# EAGLE design OPNpool r1.0 (EAGLE 9.6.2)
REV: 0.1
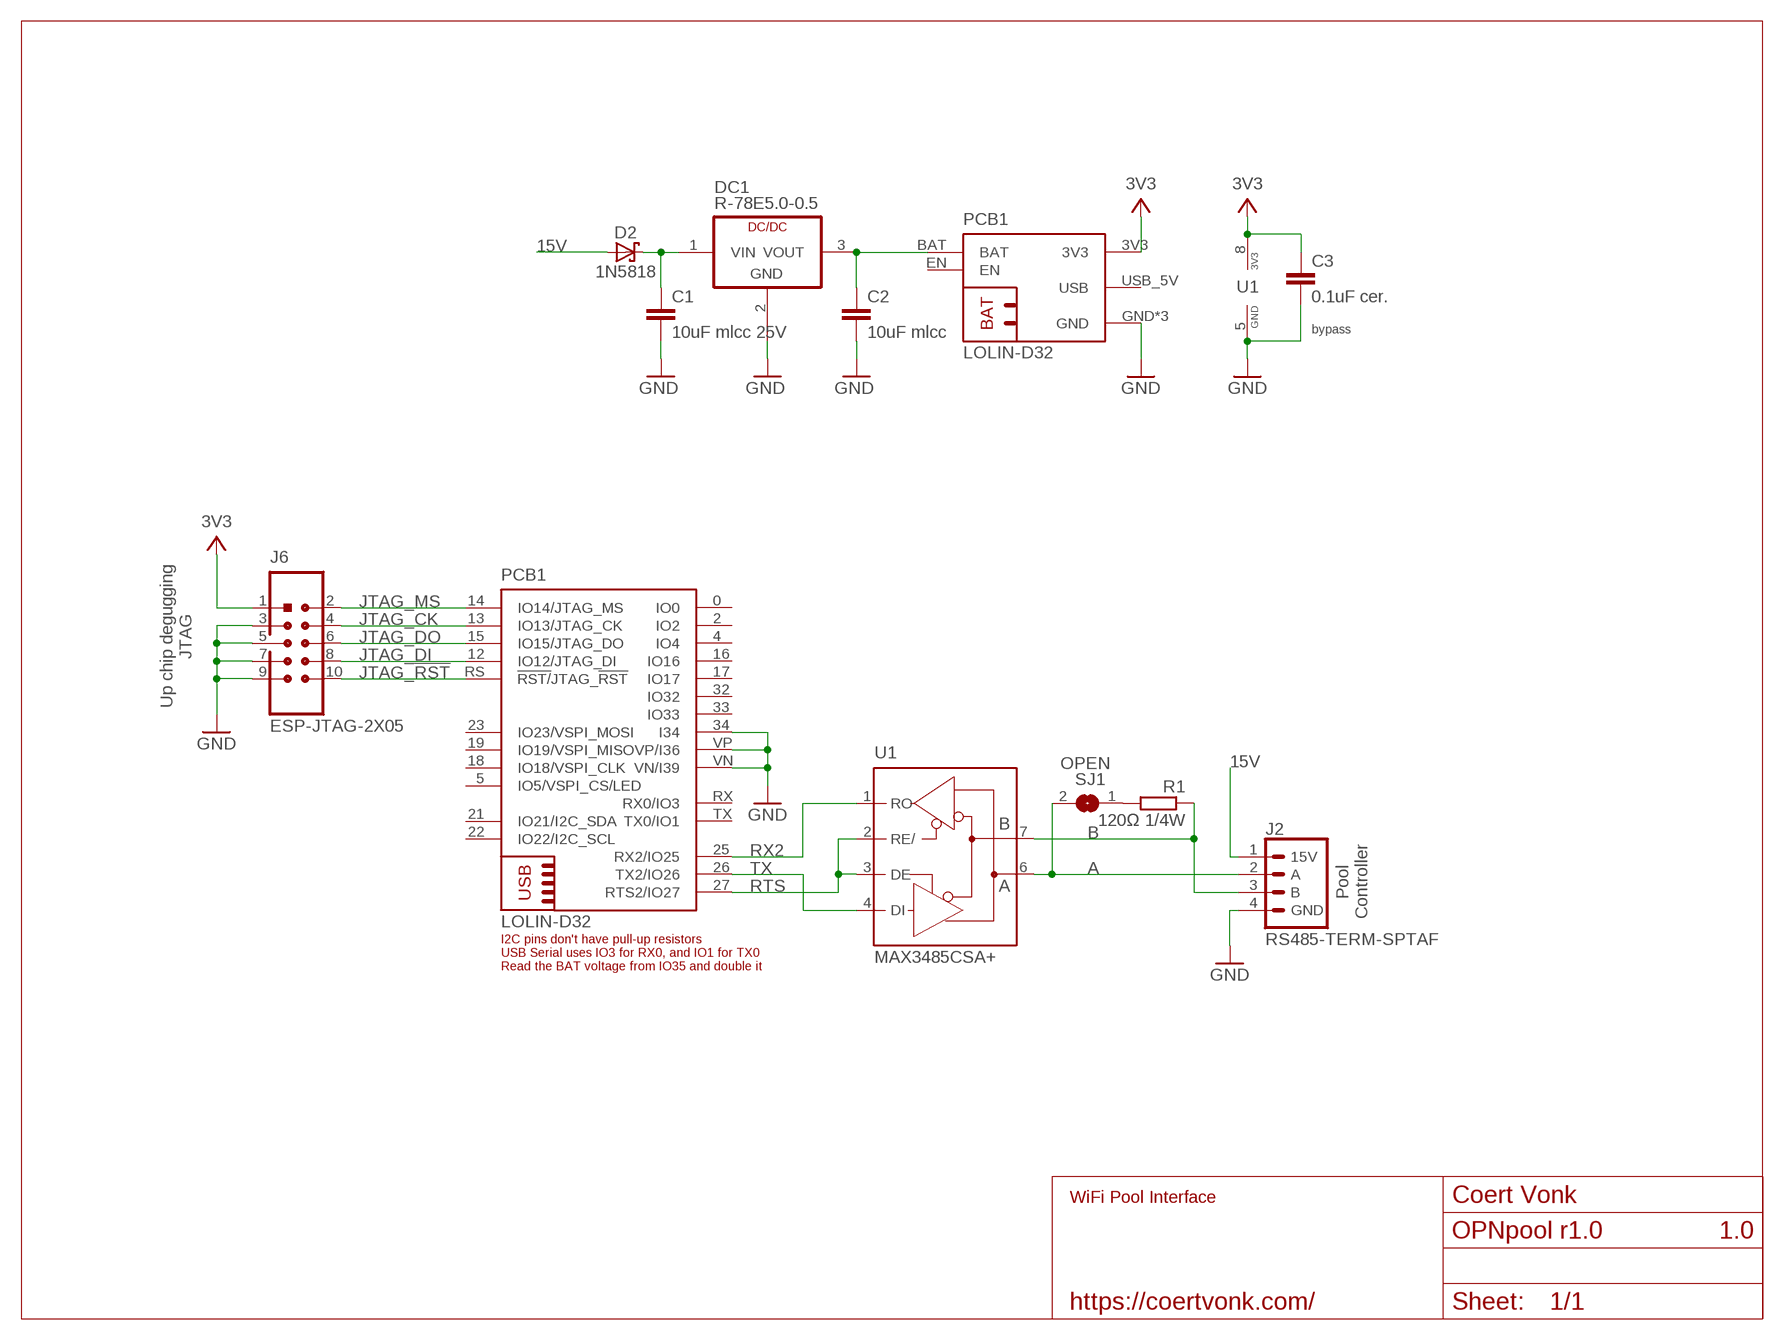
[diagram p0: schematic, sheet 1]
U$1 (FRAME_LETTER_L): AUTHOR_NAME: Coert Vonk; DESCRIPTION: WiFi Pool Interface; REV: 1.0; URL: https://coertvonk.com/

## Parts
C1  10uF mlcc 25V  C-EUC0805K  [C0805K]
C2  10uF mlcc  C-EUC0805K  [C0805K]
C3  0.1uF cer.  C-EUC0805K  [C0805K]
D2  1N5818  [DO41-7.6]
DC1  R-78E5.0-0.5  [SIP3]
J2  RS485-TERM-SPTAF  [SPTAF1/4-5,0-LL]
J6  ESP-JTAG-2X05  [2X05_SHROUDED]
PCB1  LOLIN-D32  [LOLIN-D32]
R1  120Ω 1/4W  R-EU_R0805  [R0805]
SJ1  OPEN  SJ  [SJ]
U1  MAX3485CSA+  [SO08]

## Nets
3V3: C3.1 J6.1(3V3) PCB1.3V3(P:3V3) U1.8(P:VCC)
15V: D2.A J2.1(15V)
A: J2.2(A) SJ1.2 U1.6(A)
B: J2.3(B) R1.1 U1.7(B)
GND: C1.2 C2.2 C3.2 DC1.2(GND) J2.4(GND) J6.3(GND) J6.5(GND) J6.7(GND) J6.9(GND) PCB1.34(I34) PCB1.GND(P:GND) PCB1.GND@1(P:GND) PCB1.GND@2(P:GND) PCB1.VN(VN/I39) PCB1.VP(VP/I36) U1.5(P:GND)
JTAG_!RST: J6.10(NC) PCB1.RS(!RST/!JTAG_!RST)
JTAG_CK: J6.4(TCK) PCB1.13(IO13/JTAG_CK)
JTAG_DI: J6.8(TDI) PCB1.12(IO12/JTAG_DI)
JTAG_DO: J6.6(TDO) PCB1.15(IO15/JTAG_DO)
JTAG_MS: J6.2(TMS) PCB1.14(IO14/JTAG_MS)
N$5: R1.2 SJ1.1
RTS: PCB1.27(RTS2/IO27) U1.2(RE/) U1.3(DE)
RX2: PCB1.25(RX2/IO25) U1.1(RO)
TX: PCB1.26(TX2/IO26) U1.4(DI)
VIN: C1.1 D2.C DC1.1(VIN)
VOUT: C2.1 DC1.3(VOUT) PCB1.BAT(P:BAT)
Unconnected: PCB1.0(IO0) PCB1.2(IO2) PCB1.4(IO4) PCB1.5(IO5/VSPI_CS/LED) PCB1.16(IO16) PCB1.17(IO17) PCB1.18(IO18/VSPI_CLK) PCB1.19(IO19/VSPI_MISO) PCB1.21(IO21/I2C_SDA) PCB1.22(IO22/I2C_SCL) PCB1.23(IO23/VSPI_MOSI) PCB1.32(IO32) PCB1.33(IO33) PCB1.EN(P:EN) PCB1.RX(RX0/IO3) PCB1.TX(TX0/IO1) PCB1.USB_5V(P:USB)

## Notes on the sheet
- bypass
- Up chip degugging
  JTAG
- Pool
  Controller

## Library data of the parts
C1 C2 = rcl:C-EU: CAPACITOR, European symbol; MANF: Murata Electronics; MANF#: GJ821BR61E106KE11L; MOUSER#: 81-GJ821BR61E106KE1L; SPICEPREFIX: C
C3 = rcl:C-EU: CAPACITOR, European symbol; MANF: KEMET; MANF#: C0805C104K1RECAUTO; MOUSER#: 80-C0805C104K1REAUTO; SPICEPREFIX: C
D2 = Coert Vonk:1N581*: 1.0A SCHOTTKY BARRIER RECTIFIER Source: http://www.diodes.com/datasheets/ds23001.pdf; MANF: Rectron; MANF#: 1N5818-T; MOUSER#: 583-1N5818-T
DC1 = Coert Vonk:R-78E*-0.5: DC/DC-Converter 5V 500 mA Technical specifications: Manufacturer: Recom Input Voltage: 7 - 28 V Output Voltage: 5 V Output Current: 500 mA Mfr.: R-78E5.0-0.5, data sheet <http://www.recom-power.com/pdf/Innoline/R-78Exx-0.5.pdf> Mouser: 919-R-78E5.0-0.5, abt. $2.70; MANF: RECOM Power; MANF#: R-78E5.0-0.5; MOUSER#: 919-R-78E5.0-0.5
J2 = Coert Vonk:RS485-TERM: SPTAF 1/ 4-5,0-LL - 1864451, PCB push terminal block Technical specifications: Manufacturer: Phoenix Contact Current Rating: 13.5 A Voltage Rating: 320 V Wire Gauge Range: 24 AWG to 18 AWG Mfr.#: 1864451 Mouser: 651-1864451, abt. $1.85; MANF: Phoenix Contact; MANF#: 1864451; MOUSER#: 651-1864451
J6 = Coert Vonk:ESP-JTAG: 10-pin JTAG Header, shrouded header, 2-row, 2.54 pitch Specifications: Manufacturer: Molex Voltage rating: 250 VDC Current rating: 2.5 A Operating temperature: -55 - 120 C Mfr.#: 70246-1004 Mouser #: 538-70246-1004, about $1.19, data sheet <https://www.mouser.com/datasheet/2/276/0702461004_PCB_HEADERS-229930.pdf>; DIGIKEY#: WM3478-ND; MANF: Molex; MANF#: 70246-1004; MOUSER#: 538-70246-1004
PCB1 = Coert Vonk:LOLIN-D32: Wemos LOLIN D32, ESP-WROOM-32 Technical specifications: Manufacturer: Wemos SoC: ESP32-WROOM-32, 4 MByte flash, max 240MHz Optional battery: 3.7V Lipo, connector PH-2(2.0mm) UART: CH340, micro-USB connector Mfr.#: LOLIN D32, data sheet <https://wiki.wemos.cc/products:d32:d32> Alibaba: 32808551116, about $6.50; ALIEXPRESS#: 32808551116; MANF: WEMOS Electronics; MANF#: D32
R1 = rcl:R-EU_: RESISTOR, European symbol; MANF: Bourns; MANF#: CRM0805-JW-1R5ELF; MOUSER#: 652-CRM0805JW1R5ELF; SPICEPREFIX: R
SJ1 = jumper:SJ: SMD solder JUMPER
U1 = Coert Vonk:MAX3485CSA+: RS-485 Transceiver 3.3V SMD Technical specifications: Manufacturer: Maxim Integrated Operating supply: 3.3 V, 1.1 mA Output: 3 V, 20 mA Data rate: 10 Mb/s Temperature range: 0 - 70 C Mfr.: R-78E5.0-0.5 Mouser: 919-R-78E5.0-0.5, abt. $2.70, details <https://www.mouser.com/ProductDetail/Maxim-Integrated/MAX3485CSA%2b>; MANF: Maxim Integrated; MANF#: MAX3485CSA+; MF: MAXIM; MOUSER#: 700-MAX3485CSA; MPN: MAX481CSA; OC_FARNELL: unknown; OC_NEWARK: 90C3817

## Board
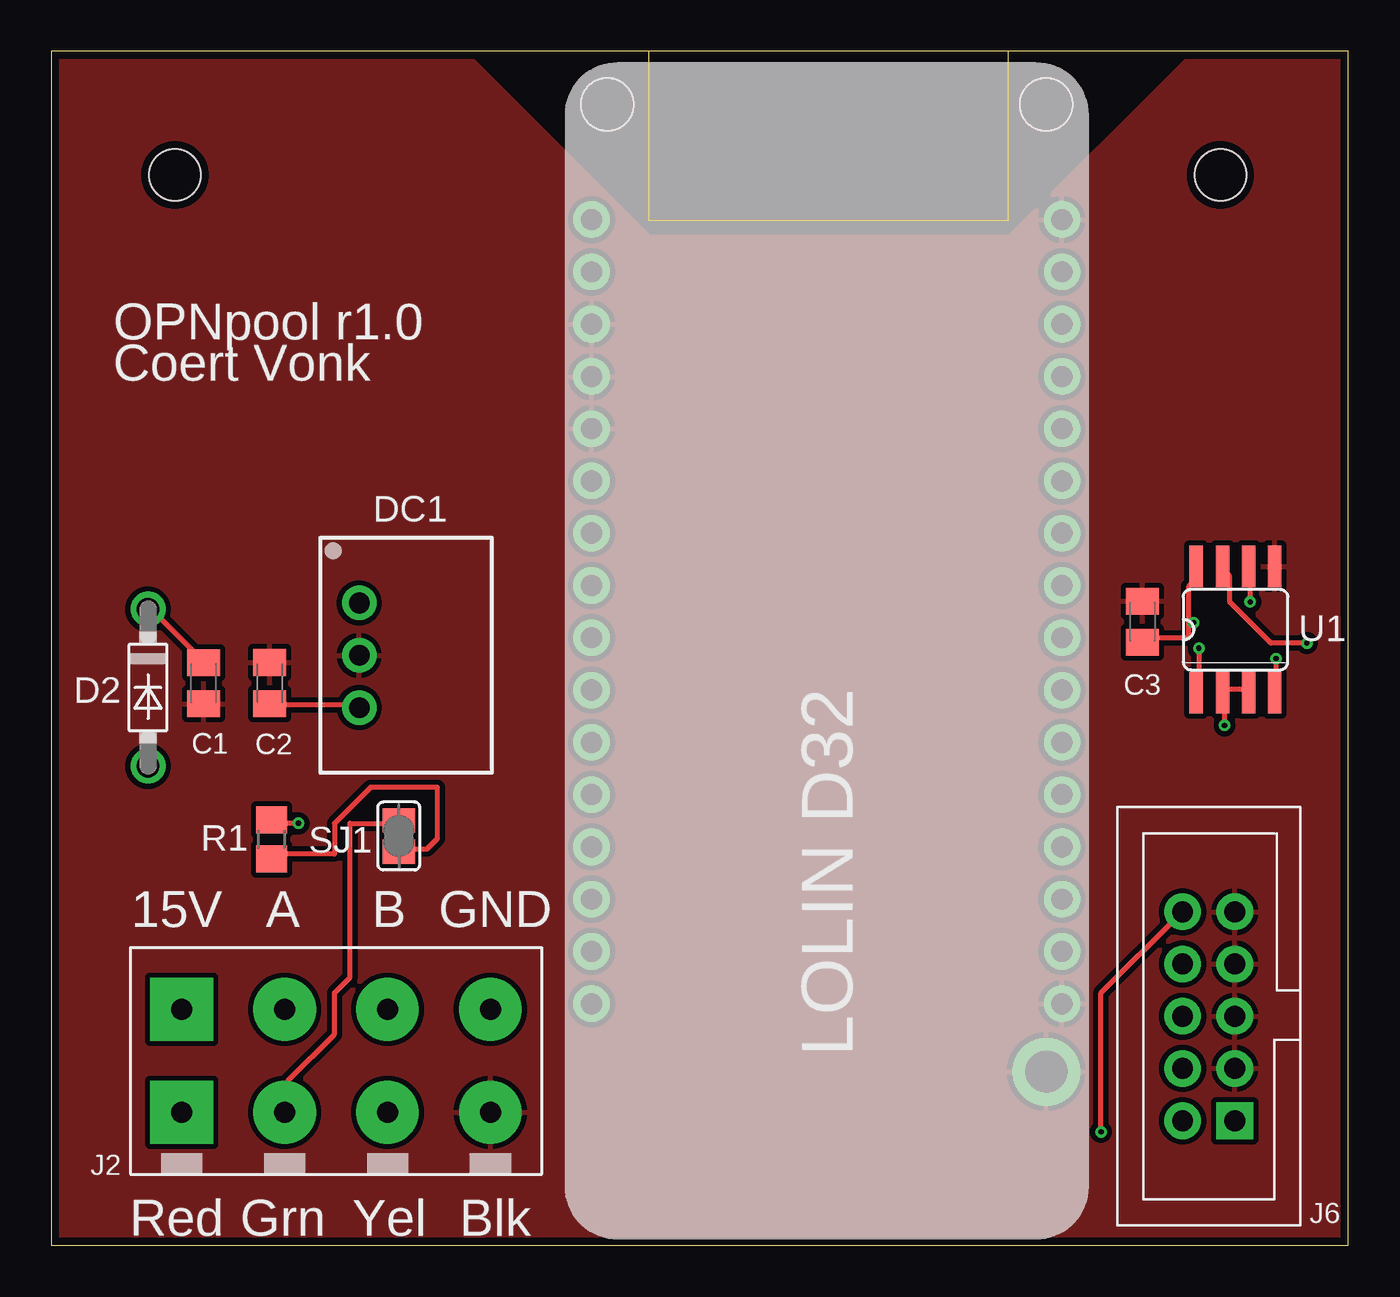
[diagram p1: board, top side]
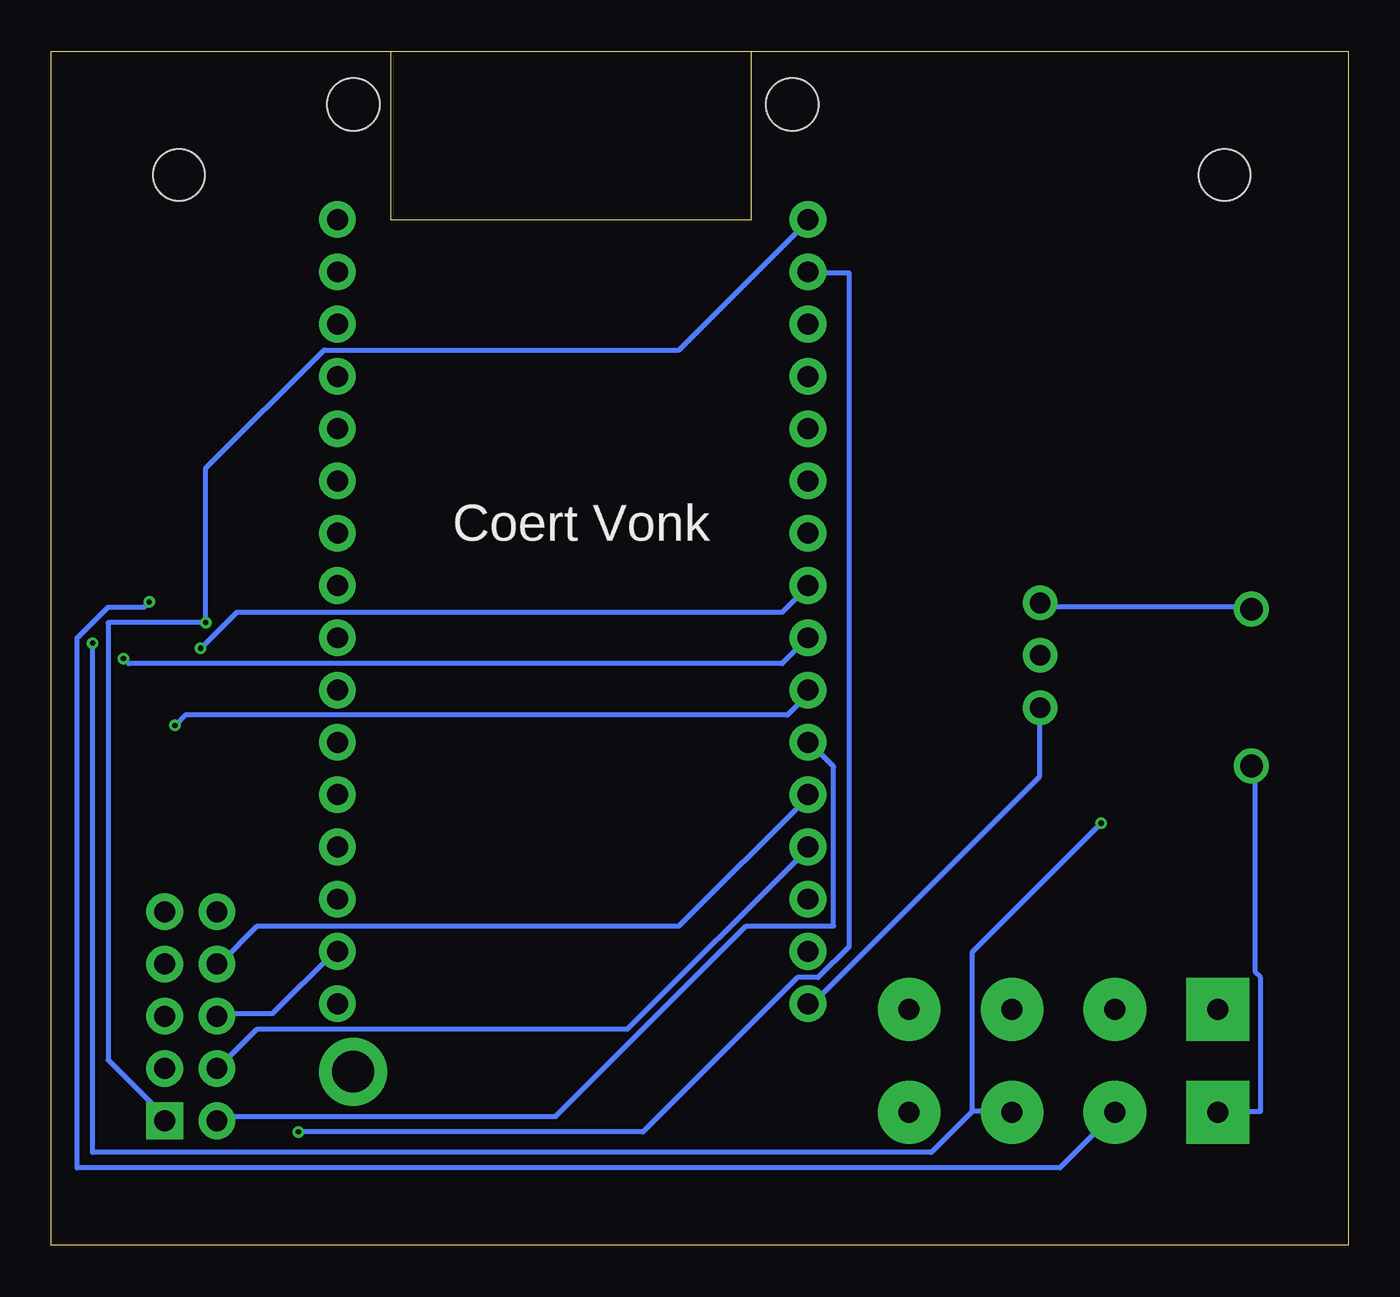
[diagram p2: board, bottom side, seen from below]

Size 63 x 58 mm. Coordinates in mm from the lower left corner, seen from the top.
Outline: 0,58 0,0 63,0 63,58 0,58
Copper layers (1*16): Top 0.035559375mm / dielectric 1.6mm / Bottom 0.035559375mm
Design rules "oshpark-2layer-auto-routing": minimum track width 10mil, minimum drill 10mil, track to track 10mil, track to pad 8mil, pad to pad 8mil, via to via 8mil, smd to smd 6mil, copper to edge 15mil, drill to drill 6mil, minimum pad ring 6mil, minimum via ring 6mil, stop-mask expansion 2.5mil, vias tented up to drill 0mil, thermal gap 10mil
Holes 2.5 mm at 6,52 56.8,52
tRestrict: area 29,50 to 47,58
bRestrict: area 29,50 to 47,58
Milling: area 29,49.8 to 46.5,58

### Footprints (pad centres in the part's own frame; a part is rotated, then mirrored left to right if it is on the bottom)
C0805K = smd 1.3 x 1.6: 1 -1,0; 2 1,0
DO41-7.6 = drill 1.1 pad 1.7: A 3.81,0; C -3.81,0
SIP3 = drill 1 pad 1.676: 1 -2.54,-2.54; 2 0,-2.54; 3 2.54,-2.54
SPTAF1/4-5,0-LL = drill 1.016 pad 3.048 square: 1 -7.713,-2.54; 1@1 -7.713,2.46 | drill 1.016 pad 3.048: 2 -2.713,-2.54; 2@1 -2.713,2.46; 3 2.287,-2.54; 3@1 2.287,2.46; 4 7.287,-2.54; 4@1 7.287,2.46
2X05_SHROUDED = drill 1.016 pad 1.778 square: 1 -5.08,-1.27 | drill 1.016 pad 1.778: 2 -5.08,1.27; 3 -2.54,-1.27; 4 -2.54,1.27; 5 0,-1.27; 6 0,1.27; 7 2.54,-1.27; 8 2.54,1.27; 9 5.08,-1.27; 10 5.08,1.27
LOLIN-D32 = drill 1.016 pad 1.778: 0 -10.16,-10.16; 2 -12.7,-10.16; 3V3 20.32,12.7; 4 -7.62,-10.16; 5 0,-10.16; 12 -7.62,12.7; 13 -10.16,12.7; 14 -5.08,12.7; 15 -15.24,-10.16; 16 -5.08,-10.16; 17 -2.54,-10.16; 18 2.54,-10.16; 19 5.08,-10.16; 21 7.62,-10.16; 22 15.24,-10.16; 23 17.78,-10.16; 25 2.54,12.7; 26 0,12.7; 27 -2.54,12.7; 32 7.62,12.7; 33 5.08,12.7; 34 10.16,12.7; BAT -17.78,12.7; EN -12.7,12.7; GND -17.78,-10.16; GND@1 20.32,-10.16; RS 17.78,12.7; RX 10.16,-10.16; TX 12.7,-10.16; USB_5V -15.24,12.7; VN 12.7,12.7; VP 15.24,12.7 | drill 2.032 pad 3.302: GND@2 -21.082,-9.398 | hole 2.54: 25.908,11.938; 25.908,-9.398
R0805 = smd 1.3 x 1.5: 1 -0.95,0; 2 0.95,0
SJ = smd 1.168 x 1.6: 1 -0.762,0; 2 0.762,0
SO08 = smd 0.66 x 2.032: 1 -1.905,-3.073; 2 -0.635,-3.073; 3 0.635,-3.073; 4 1.905,-3.073; 5 1.905,3.073; 6 0.635,3.073; 7 -0.635,3.073; 8 -1.905,3.073

### Placement (x,y rotation side)
C1  7.39,27.3 270 top
C2  10.61,27.31 90 top
C3  53.01,30.29 90 top
D2  4.69,27.09 270 top
DC1  17.5,28.66 270 top
J2  14.04,8.99 0 top
J6  56.23,11.12 90 top
PCB1  38.94,29.51 90 top
R1  10.69,19.71 270 top
SJ1  16.88,19.88 90 top
U1  57.53,29.91 0 top

### Tracks (layer width: path | path; a pad name or v marks a point on that pad's centre or on a via)
3V3  (via drill 0.25)
  Top 0.254: 55.25,30.25 55.25,32 55.5,32.25 55.5,32.75 U1.8 | 55.25,30.25 55.25,29.5 53.25,29.5 C3.1 | 55.25,30.25 v55.5,30.25
  Bottom 0.254: J6.1 57.5,6.25 60.25,9 60.25,30.25 v55.5,30.25 55.5,37.75 49.75,43.5 32.5,43.5 26.25,49.75 PCB1.3V3
15V
  Bottom 0.254: D2.A 4.5,23.25 4.5,13.25 4.25,13 4.25,6.5 6.25,6.5 J2.1
A  (via drill 0.25)
  Top 0.254: SJ1.2 16.75,20.5 14.5,20.5 14.5,13 13.75,12.25 13.75,10.25 11.5,8 11.5,6.5 J2.2 | v58.25,31.25 58.25,32.75 U1.6
  Bottom 0.254: v58.25,31.25 58.5,31 60.25,31 61.75,29.5 61.75,3.75 14,3.75 11.5,6.25 J2.2
B  (via drill 0.25)
  Top 0.254: v12,20.5 10.75,20.5 R1.1 | v61,29.25 59.25,29.25 57.25,31.25 57.25,32.5 57,32.75 U1.7
  Bottom 0.254: v12,20.5 18.25,14.25 18.25,6.5 | 18.25,6.5 16.5,6.5 J2.3 | v61,29.25 61,4.5 20.25,4.5 18.25,6.5
GND
  pour Top: 0,0 0,58 19,58 20,58 29,49 29.1,48.9 29.2,49 46.4,49 46.5,48.9 55.4,57.8 55.4,58 63,58 63,0
JTAG_!RST  (via drill 0.25)
  Top 0.254: v51,5.5 51,12.25 54.75,16 J6.10
  Bottom 0.254: v51,5.5 34.25,5.5 26.75,13 25.75,13 24.25,14.5 24.25,47.25 26,47.25 PCB1.RS
JTAG_CK
  Bottom 0.254: PCB1.13 26.25,19.25 35,10.5 53,10.5 54.75,8.75 J6.4
JTAG_DI
  Bottom 0.254: PCB1.12 26.25,21.75 32.5,15.5 53,15.5 54.75,13.75 J6.8
JTAG_DO
  Bottom 0.254: PCB1.15 49.25,14.25 52.25,11.25 54.75,11.25 J6.6
JTAG_MS
  Bottom 0.254: PCB1.14 26,24.25 25,23.25 25,15.5 29.25,15.5 38.5,6.25 54.75,6.25 J6.2
N$5
  Top 0.254: R1.2 10.75,19 13.75,19 13.75,20.5 15.5,22.25 18.75,22.25 18.75,19.75 18.25,19.25 17,19.25 SJ1.1
RTS  (via drill 0.25)
  Top 0.254: U1.3 58,27 57,27 U1.2 57,26.75 v57,25.25
  Bottom 0.254: v57,25.25 56.5,25.75 27.25,25.75 26.25,26.75 PCB1.27
RX2  (via drill 0.25)
  Top 0.254: v55.75,29 55.75,27 U1.1
  Bottom 0.254: v55.75,29 54,30.75 27.5,30.75 26.25,32 PCB1.25
TX  (via drill 0.25)
  Top 0.254: v59.5,28.5 59.5,27 U1.4
  Bottom 0.254: v59.5,28.5 59.25,28.25 27.5,28.25 PCB1.26
VIN
  Top 0.254: C1.1 7.25,28.5 4.75,31 D2.C
  Bottom 0.254: DC1.1 14.75,31 4.75,31 D2.C
VOUT
  Top 0.254: C2.1 10.75,26.25 14.75,26.25 DC1.3
  Bottom 0.254: PCB1.BAT 26,11.75 15,22.75 15,26 DC1.3

### Text on the board
tNames: Coert Vonk
bNames: Coert Vonk